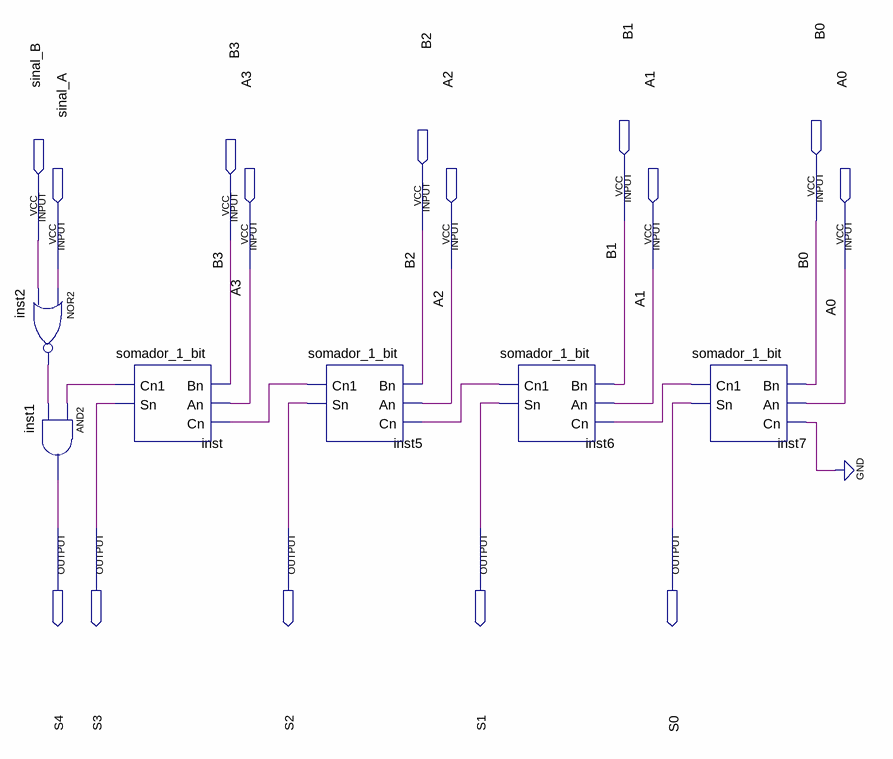
[diagram p0: schematic sheet]
// Quartus schematic subtrator_4_bits.bdf as structural Verilog: 6 symbols, 15 pins
module subtrator_4_bits (
  input  B1,
  input  B0,
  input  B2,
  input  sinal_B,
  input  B3,
  input  sinal_A,
  input  A3,
  input  A2,
  input  A1,
  input  A0,
  output S4,
  output S3,
  output S2,
  output S1,
  output S0
);

  wire inst2_out, inst5_cn1, inst6_cn1, inst7_cn1, inst_cn1;

  nor inst2 (inst2_out, sinal_A, sinal_B);
  and inst1 (S4, inst_cn1, inst2_out);
  somador_1_bit inst (.Bn(B3), .An(A3), .Cn(inst5_cn1), .Cn1(inst_cn1), .Sn(S3));
  somador_1_bit inst5 (.Bn(B2), .An(A2), .Cn(inst6_cn1), .Cn1(inst5_cn1), .Sn(S2));
  somador_1_bit inst6 (.Bn(B1), .An(A1), .Cn(inst7_cn1), .Cn1(inst6_cn1), .Sn(S1));
  somador_1_bit inst7 (.Bn(B0), .An(A0), .Cn(1'b0), .Cn1(inst7_cn1), .Sn(S0));
endmodule
